# Altium schematic sheet Power Supply Section.SchDoc
size A4; SheetNumber: 2; SheetTotal: 6
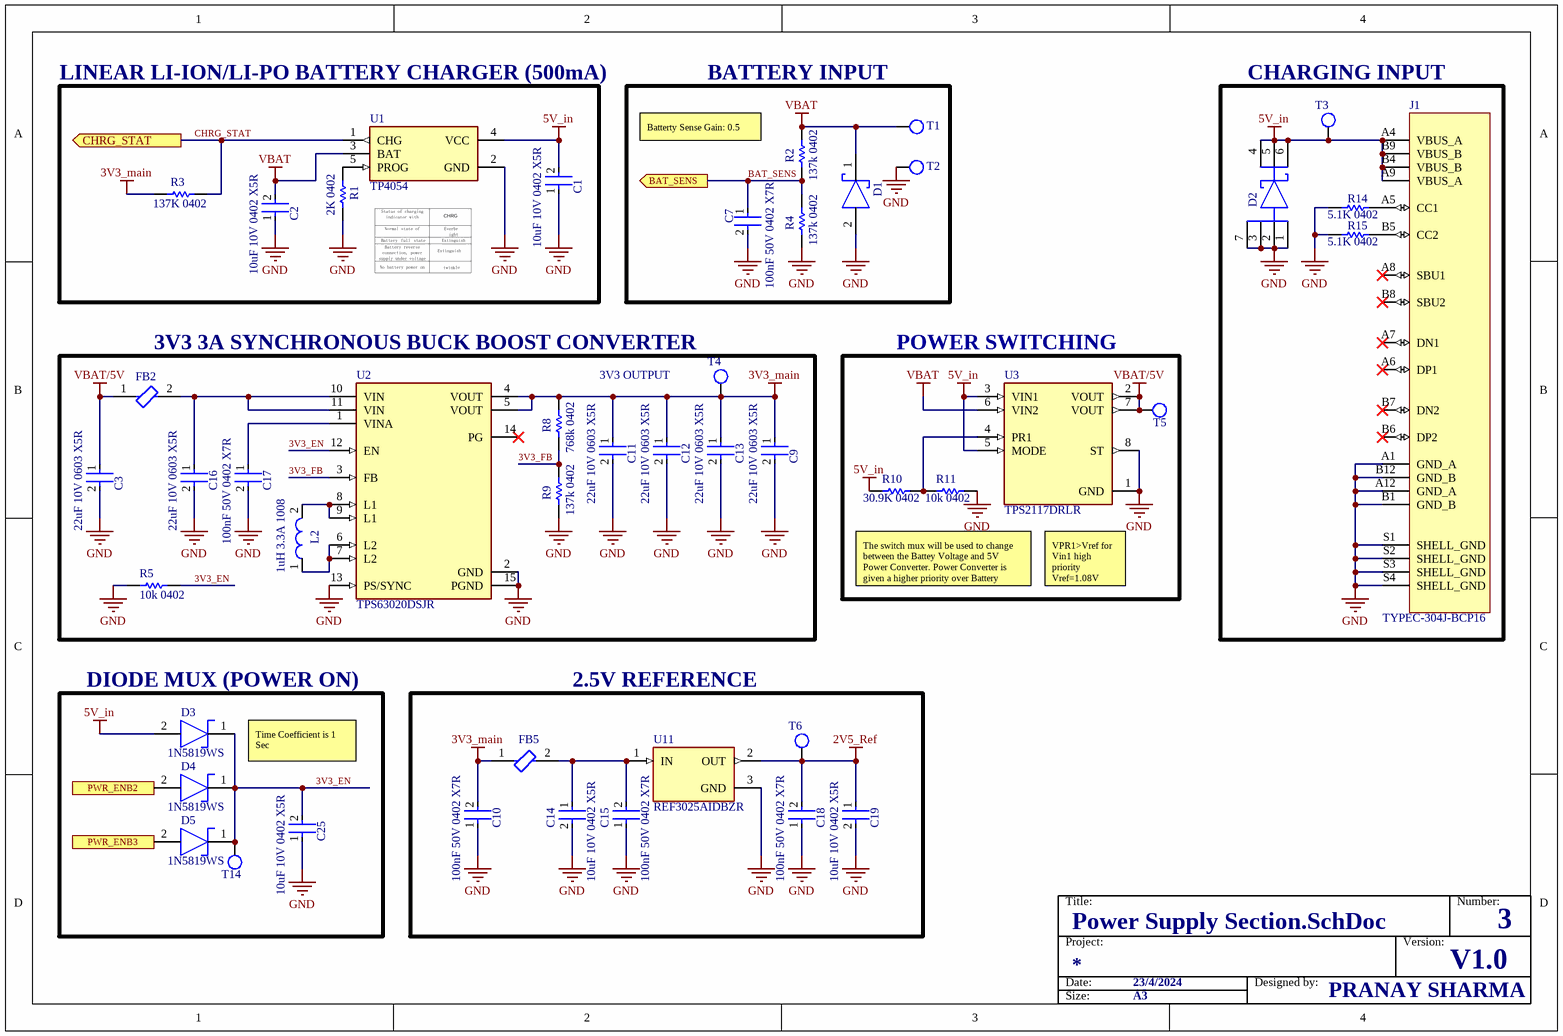
[diagram p0: Power Supply Section.SchDoc]

## Parts
C1  10uF 10V 0402 X5R  [0402 IPC CLASS C CAPACITOR]
C2  10uF 10V 0402 X5R  [0402 IPC CLASS C CAPACITOR]
C3  22uF 10V 0603 X5R  [0603 IPC CLASS C CAPACITOR]
C7  100nF 50V 0402 X7R  [0402 IPC CLASS C CAPACITOR]
C9  22uF 10V 0603 X5R  [0603 IPC CLASS C CAPACITOR]
C10  100nF 50V 0402 X7R  [0402 IPC CLASS C CAPACITOR]
C11  22uF 10V 0603 X5R  [0603 IPC CLASS C CAPACITOR]
C12  22uF 10V 0603 X5R  [0603 IPC CLASS C CAPACITOR]
C13  22uF 10V 0603 X5R  [0603 IPC CLASS C CAPACITOR]
C14  10uF 10V 0402 X5R  [0402 IPC CLASS C CAPACITOR]
C15  100nF 50V 0402 X7R  [0402 IPC CLASS C CAPACITOR]
C16  22uF 10V 0603 X5R  [0603 IPC CLASS C CAPACITOR]
C17  100nF 50V 0402 X7R  [0402 IPC CLASS C CAPACITOR]
C18  100nF 50V 0402 X7R  [0402 IPC CLASS C CAPACITOR]
C19  10uF 10V 0402 X5R  [0402 IPC CLASS C CAPACITOR]
C25  10uF 10V 0402 X5R  [0402 IPC CLASS C CAPACITOR]
D1  SP3031-01ETG  [SOD882 IPC-C]  (value not drawn)
D2  TVS0500DRVR  [DRV0006A IPC-C]  (value not drawn)
D3  1N5819WS  [SOD-323 IPC-C]
D4  1N5819WS  [SOD-323 IPC-C]
D5  1N5819WS  [SOD-323 IPC-C]
FB2  BLM21SP111SN1D  [0603 IPC CLASS C FERRITE BEAD]  (value not drawn)
FB5  BLM15AX102SN1D  [0402 IPC CLASS C FERRITE BEAD]  (value not drawn)
J1  TYPEC-304J-BCP16  [VALCON_CSP-USC16-TR]
L2  1uH 3.3A 1008  [1008 Inductor IPC-C]
R1  2K 0402  [0402 IPC CLASS C RESISTOR]
R2  137k 0402  [0402 IPC CLASS C RESISTOR]
R3  137K 0402  [0402 IPC CLASS C RESISTOR]
R4  137k 0402  [0402 IPC CLASS C RESISTOR]
R5  10k 0402  [0402 IPC CLASS C RESISTOR]
R8  768k 0402  [0402 IPC CLASS C RESISTOR]
R9  137k 0402  [0402 IPC CLASS C RESISTOR]
R10  30.9K 0402  [0402 IPC CLASS C RESISTOR]
R11  10k 0402  [0402 IPC CLASS C RESISTOR]
R14  5.1K 0402  [0402 IPC CLASS C RESISTOR]
R15  5.1K 0402  [0402 IPC CLASS C RESISTOR]
T1  Test Point TH  [Test Point TH]  (value not drawn)  (no BOM)
T2  Test Point TH  [Test Point TH]  (value not drawn)  (no BOM)
T3  TP  [Testpoint1]  (value not drawn)  (no BOM)
T4  TP  [Testpoint1]  (value not drawn)  (no BOM)
T5  TP  [Testpoint1]  (value not drawn)  (no BOM)
T6  TP  [Testpoint1]  (value not drawn)  (no BOM)
T14  TP  [Testpoint1]  (value not drawn)  (no BOM)
U1  TP4054  [DBV0005A IPC-C]
U2  TPS63020DSJR  [FP-DSJ0014A-MFG]
U3  TPS2117DRLR  [DRL0008A IPC-C]
U11  REF3025AIDBZR  [SOT23-IPC_C]

## Blocks framed on the sheet
LINEAR LI-ION/LI-PO BATTERY CHARGER (500mA): C1 C2 R1 R3 U1
BATTERY INPUT: C7 D1 R2 R4 T1 T2
CHARGING INPUT: D2 J1 R14 R15 T3
3V3 3A SYNCHRONOUS BUCK BOOST CONVERTER: C3 C9 C11-C13 C16 C17 FB2 L2 R5 R8 R9 T4 U2
POWER SWITCHING: R10 R11 T5 U3
DIODE MUX (POWER ON): C25 D3-D5 T14
2.5V REFERENCE: C10 C14 C15 C18 C19 FB5 T6 U11

## Ports
BAT_SENS (out), CHRG_STAT (out), PWR_ENB2 (in), PWR_ENB3 (in)

## Nets
2V5_Ref: C18.2 C19.1 T6.0 U11.2(OUT)
3V3_main: C9.1 C10.2 C11.1 C12.1 C13.1 FB5.1 R3.1 R8.1 T4.0 U2.4(VOUT) U2.5(VOUT)
5V_in: C1.2 D2.4 D2.5 D2.6 D3.2(A) J1.A4(VBUS_A) J1.A9(VBUS_A) J1.B4(VBUS_B) J1.B9(VBUS_B) R10.2 T3.0 U1.4(VCC) U3.3(VIN1) U3.5(MODE)
GND: C1.1 C2.1 C3.2 C7.2 C9.2 C10.1 C11.2 C12.2 C13.2 C14.2 C15.1 C16.2 C17.2 C18.1 C19.2 C25.1 D1.2(A) D2.1(C) D2.2(A) D2.3 D2.7 J1.A1(GND_A) J1.A12(GND_A) J1.B1(GND_B) J1.B12(GND_B) J1.S1(SHELL_GND) J1.S2(SHELL_GND) J1.S3(SHELL_GND) J1.S4(SHELL_GND) R1.2 R4.1 R5.2 R9.1 R11.1 R14.1 R15.1 T2.0 U1.2(GND) U2.2(GND) U2.13(PS/SYNC) U2.15(PGND) U3.1(GND) U3.8(ST) U11.3(GND)
VBAT: C2.2 D1.1(C) R2.2 T1.0 U1.3(BAT) U3.6(VIN2)
VBAT/5V: C3.1 FB2.1 T5.0 U3.2(VOUT) U3.7(VOUT)
3V3_EN: C25.2 D3.1(C) D4.1(C) D5.1(C) R5.1 T14.0 U2.12(EN)
3V3_FB: R8.2 R9.2 U2.3(FB)
BAT_SENS: C7.1 R2.1 R4.2 ; port BAT_SENS
CHRG_STAT: R3.2 U1.1(CHG) ; port CHRG_STAT
PWR_ENB2: D4.2(A) ; port PWR_ENB2
PWR_ENB3: D5.2(A) ; port PWR_ENB3
NetC14_1: C14.1 C15.2 FB5.2 U11.1(IN)
NetC16_1: C16.1 FB2.2 U2.10(VIN) U2.11(VIN)
NetC17_1: C17.1 U2.1(VINA)
NetJ1_A5: J1.A5(CC1) R14.2
NetJ1_B5: J1.B5(CC2) R15.2
NetL2_1: L2.1 U2.6(L2) U2.7(L2)
NetL2_2: L2.2 U2.8(L1) U2.9(L1)
NetR1_1: R1.1 U1.5(PROG)
NetR10_1: R10.1 R11.2 U3.4(PR1)

Not connected (* = marked no-connect by the designer): J1 A6(DP1)* A7(DN1)* A8(SBU1)* B6(DP2)* B7(DN2)* B8(SBU2)*; U2 14(PG)*

## Notes on the sheet
- (near R2) Batterty Sense Gain: 0.5
- 3V3 OUTPUT
- The switch mux will be used to change between the Battey Voltage and 5V Power Converter. Power Converter is given a higher priority over Battery
- (near U3) VPR1>Vref for Vin1 high priority
  Vref=1.08V
- Time Coefficient is 1 Sec
- Title:
- Number:
- Date:
- Project:
- 23/4/2024
- Designed by:
- Version:
- V1.0
- 3
- Size:
- A3
- PRANAY SHARMA

## Library data of the parts
J1 = USB Type C
L2 = DFE252012F-1R0M=P2
R1 = 2K 1% 0402
R2 R4 R5 R8 R9 R11 = 10k 1% 0402
R3 = 137K 1% 0402
R10 = 30.9K 1%  0402
R14 R15 = 5.1K 1% 0402
T3-T6 T14 = Testpoint1
U2 = CMP-2000-07282-2